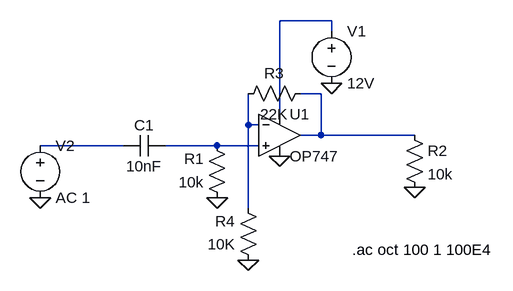
[diagram p0: schematic 2021-02-24-opamp-passa-alto-1ordine.asc]
2021-02-24-opamp-passa-alto-1ordine.asc, the LTspice schematic file:
Version 4
SHEET 1 880 680
WIRE 416 128 336 128
WIRE 416 144 416 128
WIRE 400 240 368 240
WIRE 336 272 336 128
WIRE 288 288 288 240
WIRE 304 288 288 288
WIRE 400 304 400 240
WIRE 400 304 368 304
WIRE 544 304 400 304
WIRE 96 320 -32 320
WIRE 240 320 160 320
WIRE 304 320 240 320
WIRE 288 416 288 288
FLAG -32 400 0
FLAG 240 400 0
FLAG 336 336 0
FLAG 416 224 0
FLAG 544 384 0
FLAG 288 496 0
SYMBOL Opamps/OP747 336 240 R0
SYMATTR InstName U1
SYMBOL res 256 416 R180
WINDOW 0 36 76 Left 2
WINDOW 3 36 40 Left 2
SYMATTR InstName R1
SYMATTR Value 10k
SYMBOL cap 160 304 R90
WINDOW 0 0 32 VBottom 2
WINDOW 3 32 32 VTop 2
SYMATTR InstName C1
SYMATTR Value 10nF
SYMBOL voltage 416 128 R0
SYMATTR InstName V1
SYMATTR Value 12V
SYMBOL res 528 288 R0
SYMATTR InstName R2
SYMATTR Value 10k
SYMBOL voltage -32 304 R0
SYMATTR InstName V2
SYMATTR Value AC 1
SYMBOL res 384 224 R90
WINDOW 0 0 56 VBottom 2
WINDOW 3 32 56 VTop 2
SYMATTR InstName R3
SYMATTR Value 22K
SYMBOL res 304 512 R180
WINDOW 0 36 76 Left 2
WINDOW 3 36 40 Left 2
SYMATTR InstName R4
SYMATTR Value 10K
TEXT 448 480 Left 2 !.ac oct 100 1 100E4

The netlist it stands for:
* 2021-02-24-opamp-passa-alto-1ordine.asc
XU1 N005 N003 N001 0 N002 OP747  ; pins In+ In- V+ V- OUT
R1 0 N005 10k
C1 N005 N004 10nF
V1 N001 0 12V
R2 N002 0 10k
V2 N004 0 AC 1
R3 N002 N003 22K
R4 0 N003 10K
.ac oct 100 1 100E4
.backanno
.end